# EAGLE design power supply board (EAGLE 9.6.2)
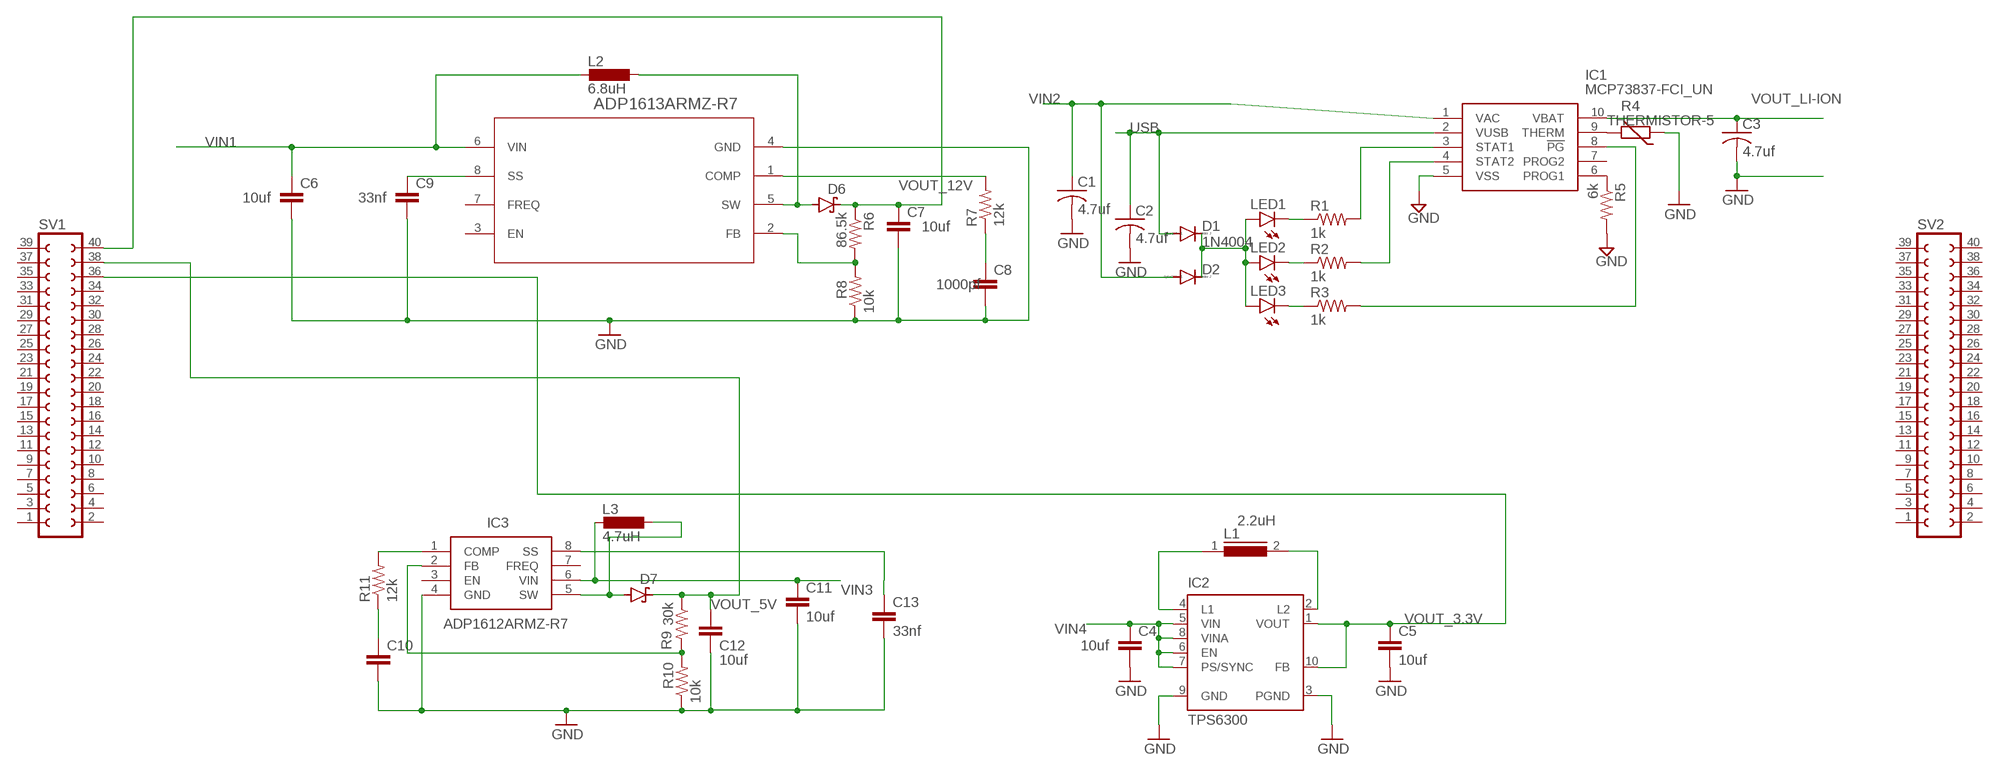
[diagram p0: schematic, sheet 1]

## Parts
C1  4.7uf  C-US025-024X044  [C025-024X044]
C2  4.7uf  C-US025-024X044  [C025-024X044]
C3  4.7uf  C-US025-024X044  [C025-024X044]
C4  10uf  C2,5-3  [C2.5-3]
C5  10uf  C2,5-3  [C2.5-3]
C6  10uf  C2,5-3  [C2.5-3]
C7  10uf  C2,5-3  [C2.5-3]
C8  1000pf  C2,5-3  [C2.5-3]
C9  33nf  C2,5-3  [C2.5-3]
C10  1200pf  C2,5-3  [C2.5-3]
C11  10uf  C2,5-3  [C2.5-3]
C12  10uf  C2,5-3  [C2.5-3]
C13  33nf  C2,5-3  [C2.5-3]
D1  1N4004  [DO41-10]
D2  1N4004  [DO41-10]
D6  3A,40V  MBRS320T3  [SMC]
D7  3A,40V  MBRS320T3  [SMC]
IC1  MCP73837-FCI_UN  [SOP50P490X110-10N]
IC2  TPS6300  [DRC-S-PVSON-N10]
IC3  ADP1612ARMZ-R7  [SOP65P490X110-8N]
L1  2.2uH  SLF7045  [SLF7045]
L2  6.8uH  DO3316P  [DO3316P]
L3  4.7uH  DO3316P  [DO3316P]
LED1  LAP4-BOTTOM  [P47F-BOTTOM]
LED2  LAP4-BOTTOM  [P47F-BOTTOM]
LED3  LAP4-BOTTOM  [P47F-BOTTOM]
R1  1k  R-US_0204/2V  [0204V]
R2  1k  R-US_0204/2V  [0204V]
R3  1k  R-US_0204/2V  [0204V]
R4  THERMISTOR-5  [R-5]
R5  6k  R-US_0204/2V  [0204V]
R6  86.5k  R-US_M0805  [M0805]
R7  12k  R-US_M0805  [M0805]
R8  10k  R-US_M0805  [M0805]
R9  30k  R-US_M0805  [M0805]
R10  10k  R-US_M0805  [M0805]
R11  12k  R-US_M0805  [M0805]
SV1  FE20-2  [FE20-2]
SV2  FE20-2  [FE20-2]
U1  ADP1613ARMZ-R7  [RM_8_ADI]

## Nets
GND: C1.2 C2.2 C3.2 C4.2 C5.2 C6.2 C7.2 C8.2 C9.2 C10.2 C11.2 C12.2 C13.2 IC1.5(VSS) IC2.3(PGND) IC2.9(GND) IC3.4(GND) R4.1 R5.2 R8.1 R10.1 U1.4(GND)
N$1: LED1.C R1.1
N$2: LED2.C R2.1
N$3: D1.C D2.C LED1.A LED2.A LED3.A
N$4: IC1.3(STAT1) R1.2
N$5: LED3.C R3.1
N$8: IC1.4(STAT2) R2.2
N$9: IC1.8(!PG) R3.2
N$10: IC1.6(PROG1) R5.1
N$11: IC1.9(THERM) R4.2
N$13: IC2.4(L1) L1.1
N$14: C13.1 IC3.8(SS)
N$15: IC2.2(L2) L1.2
N$16: D6.A L2.2 U1.5(SW)
N$18: C10.1 R11.1
N$19: C9.1 U1.8(SS)
N$20: R6.2 R8.2 U1.2(FB)
N$21: IC3.1(COMP) R11.2
N$22: R7.2 U1.1(COMP)
N$23: C8.1 R7.1
N$25: IC3.2(FB) R9.2 R10.2
USB: C2.1 D1.A IC1.2(VUSB)
VIN1: C6.1 L2.1 U1.6(VIN)
VIN2: C1.1 D2.A IC1.1(VAC)
VIN3: C11.1 IC3.6(VIN) L3.1
VIN4: C4.1 IC2.5(VIN) IC2.6(EN) IC2.7(PS/SYNC) IC2.8(VINA)
VOUT1: D7.A IC3.5(SW) L3.2
VOUT_3.3V: C5.1 IC2.1(VOUT) IC2.10(FB) SV1.36
VOUT_5V: C12.1 D7.C R9.1 SV1.38
VOUT_12V: C7.1 D6.C R6.1 SV1.40
VOUT_LI-ION: C3.1 IC1.10(VBAT)
Unconnected: IC1.7(PROG2) IC2.TH IC3.3(EN) IC3.7(FREQ) SV1.1 SV1.2 SV1.3 SV1.4 SV1.5 SV1.6 SV1.7 SV1.8 SV1.9 SV1.10 SV1.11 SV1.12 SV1.13 SV1.14 SV1.15 SV1.16 SV1.17 SV1.18 SV1.19 SV1.20 SV1.21 SV1.22 SV1.23 SV1.24 SV1.25 SV1.26 SV1.27 SV1.28 SV1.29 SV1.30 SV1.31 SV1.32 SV1.33 SV1.34 SV1.35 SV1.37 SV1.39 SV2.1 SV2.2 SV2.3 SV2.4 SV2.5 SV2.6 SV2.7 SV2.8 SV2.9 SV2.10 SV2.11 SV2.12 SV2.13 SV2.14 SV2.15 SV2.16 SV2.17 SV2.18 SV2.19 SV2.20 SV2.21 SV2.22 SV2.23 SV2.24 SV2.25 SV2.26 SV2.27 SV2.28 SV2.29 SV2.30 SV2.31 SV2.32 SV2.33 SV2.34 SV2.35 SV2.36 SV2.37 SV2.38 SV2.39 SV2.40 U1.3(EN) U1.7(FREQ)

## Library data of the parts
C1-C3 = rcl:C-US: CAPACITOR, American symbol; SPICEPREFIX: C
C4-C13 = capacitor-wima:C: CAPACITOR naming: grid - package width
D1 D2 = diode:1N4004: DIODE general purpose rectifier, 1 A
D6 D7 = diode:MBRS3*0T3: SCHOTTKY BARRIER RECTIFIER 3.0 AMPERES 20, 30, 40 VOLT Source: MBRS340T3-D.pdf
IC1 = MCP73837-FCI_UN:MCP73837-FCI_UN: Li-Ion Charger USB/DC 4.2V 1A PG MSOP10 Source: Datasheet <http://ww1.microchip.com/downloads/en/DeviceDoc/22071B.pdf>; ARROW_PART_NUMBER: MCP73837-FCI/UN; ARROW_PRICE-STOCK: https://www.arrow.com/en/products/mcp73837-fciun/microchip-technology; DESCRIPTION: Li-Ion Charger USB/DC 4.2V 1A PG MSOP10; HEIGHT: 1.1mm; MANUFACTURER_NAME: Microchip; MANUFACTURER_PART_NUMBER: MCP73837-FCI/UN; MOUSER_PART_NUMBER: 579-MCP73837-FCI/UN; MOUSER_PRICE-STOCK: https://www.mouser.co.uk/ProductDetail/Microchip-Technology/MCP73837-FCI-UN?qs=hH%252BOa0VZEiDKGj395FRsiw%3D%3D
IC2 = texas:TPS6300*: HIGH EFFICIENT SINGLE INDUCTOR BUCK-BOOST CONVERTER WITH 1.8-A SWITCHES Source: http://focus.ti.com/lit/ds/symlink/tps63001.pdf; MPN: TPS63000DRCTG4; OC_FARNELL: 1511852; OC_NEWARK: 59M7217
IC3 = ADP1612ARMZ-R7:ADP1612ARMZ-R7: Analog Devices ADP1612ARMZ-R7, Step Up DC-DC Converter, 1.9A, Adjustable, 5.5 20 V, 8-Pin MSOP Source: Datasheet <http://uk.rs-online.com/web/p/products/7427727P>; ARROW_PART_NUMBER: ADP1612ARMZ-R7; ARROW_PRICE-STOCK: https://www.arrow.com/en/products/adp1612armz-r7/analog-devices; DESCRIPTION: Analog Devices ADP1612ARMZ-R7, Step Up DC-DC Converter, 1.9A, Adjustable, 5.5 20 V, 8-Pin MSOP; HEIGHT: 1.1mm; MANUFACTURER_NAME: Analog Devices; MANUFACTURER_PART_NUMBER: ADP1612ARMZ-R7; MOUSER_PART_NUMBER: 584-ADP1612ARMZ-R7; MOUSER_PRICE-STOCK: https://www.mouser.com/Search/Refine.aspx?Keyword=584-ADP1612ARMZ-R7
L1 = inductors:SLF7045: SMD Inductors(Coils) For Power Line (Wound, Magnetic Shielded) Source: TDK, e531_slf7045.pdf; SPICEPREFIX: L
L2 L3 = inductor-coilcraft:DO3316P: COILCRAFT; OC_FARNELL: unknown; OC_NEWARK: unknown
LED1-LED3 = led:*P4: PointLED® Enhanced Thinfilm LED TOP & BOTTOM mount LS P47F, LR P47F, LA P47F, LY P47F, LT P4SG, LB P4SG, LW P4SG Source: http://catalog.osram-os.com .. LA_LR_LS_LY_P47F_Pb_free.pdf
R1-R3 R5-R11 = rcl:R-US_: RESISTOR, American symbol; SPICEPREFIX: R
R4 = varistor:THERMISTOR: THERMISTOR
SV1 SV2 = con-lsta:FE20-2: FEMALE HEADER; OC_FARNELL: unknown; OC_NEWARK: unknown
U1 = ADP:ADP1613ARMZ-R7: ADP1613ARMZ-R7 Li-Ion/Li-Polymer battery chargers; BUILT_BY: EMA_UL_Team; MANUFACTURER_PART_NUMBER: ADP1613ARMZ-R7; SOURCELIBRARY: Analog_2015-12-15; VENDOR: Analog Devices Inc

## Board
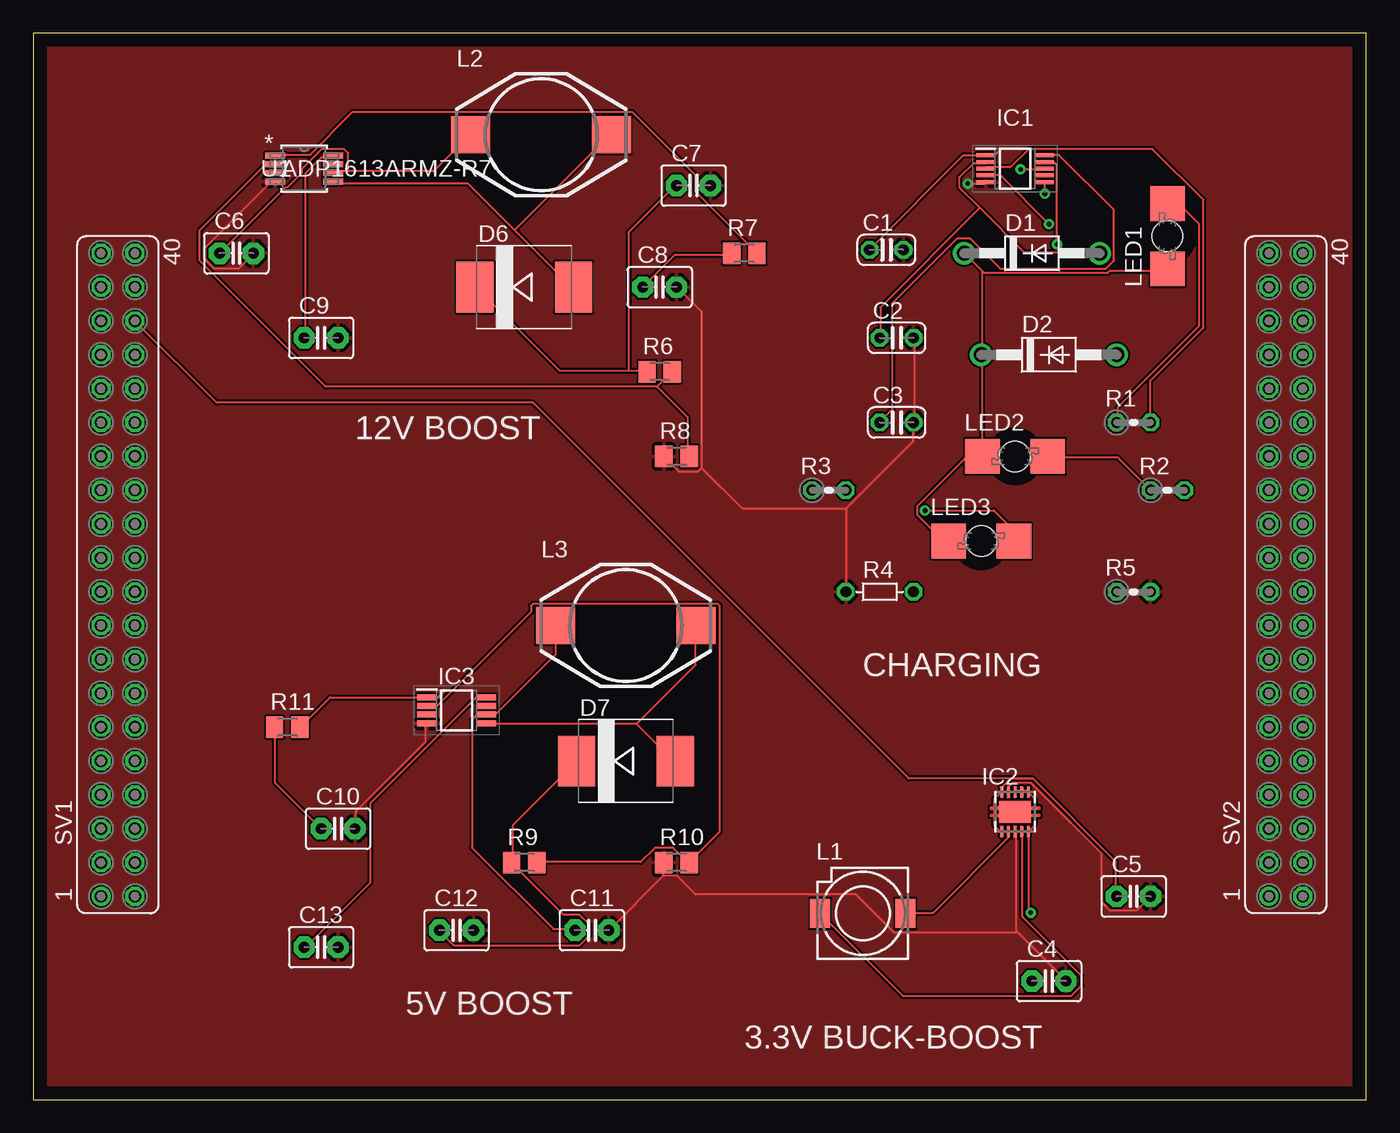
[diagram p1: board, top side]
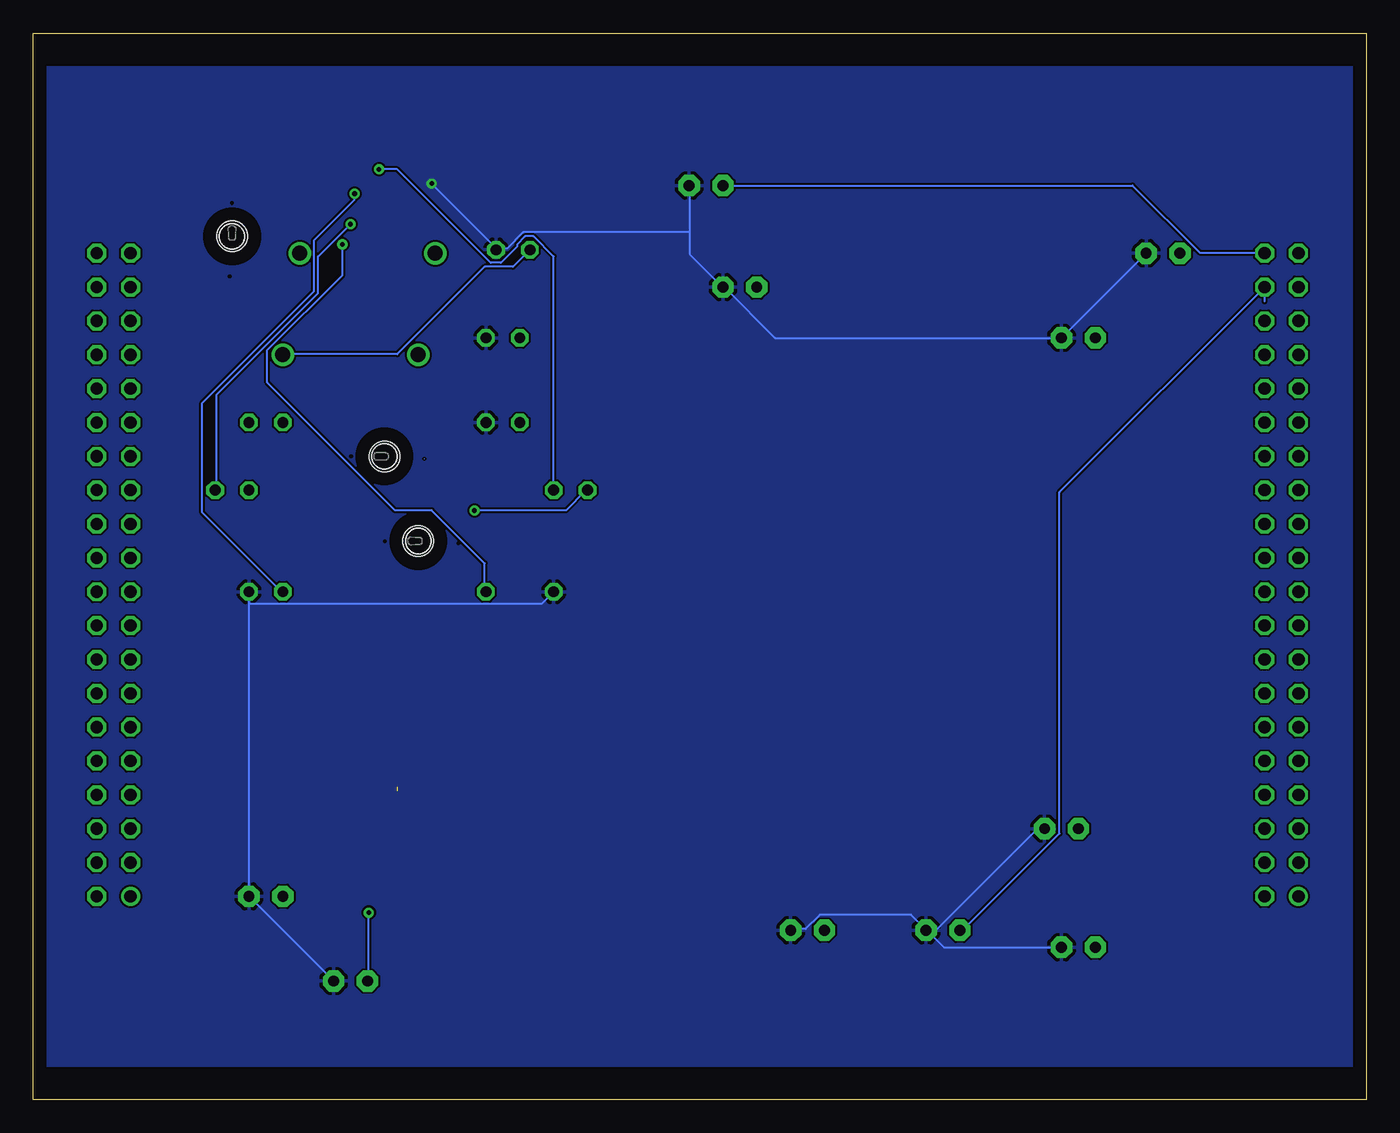
[diagram p2: board, bottom side, seen from below]

Size 100 x 80 mm. Coordinates in mm from the lower left corner, seen from the top.
Outline: 0,0 100,0 100,80 0,80 0,0
Copper layers (1*16): Top 0.035mm / dielectric 1.5mm / Bottom 0.035mm
Design rules "default": minimum track width 6mil, minimum drill 0.35mm, track to track 6mil, track to pad 6mil, pad to pad 6mil, via to via 6mil, smd to smd 6mil, copper to edge 40mil, drill to drill 6mil, minimum pad ring 10mil, minimum via ring 8mil, stop-mask expansion 4mil, vias tented up to drill 0mil, thermal gap 10mil

### Footprints (pad centres in the part's own frame; a part is rotated, then mirrored left to right if it is on the bottom)
C025-024X044 = drill 0.813 octagon: 1 -1.27,0; 2 1.27,0
C2.5-3 = drill 0.813 pad 1.6 octagon: 1 -1.27,0; 2 1.27,0
DO41-10 = drill 1.118: A 5.08,0; C -5.08,0
SMC = smd 2.8 x 3.8: A 3.7,0; C -3.7,0
SOP50P490X110-10N = smd 1.4 x 0.3: 1 -2.2,1; 2 -2.2,0.5; 3 -2.2,0; 4 -2.2,-0.5; 5 -2.2,-1; 6 2.2,-1; 7 2.2,-0.5; 8 2.2,0; 9 2.2,0.5; 10 2.2,1
DRC-S-PVSON-N10 = smd 0.28 x 0.85: 1 -1,-1.475; 2 -0.5,-1.475; 3 0,-1.475; 4 0.5,-1.475; 5 1,-1.475; 6 1,1.475; 7 0.5,1.475; 8 0,1.475; 9 -0.5,1.475; 10 -1,1.475 | smd 2.4 x 1.65: TH 0,0
SOP65P490X110-8N = smd 1.45 x 0.45: 1 -2.225,0.975; 2 -2.225,0.325; 3 -2.225,-0.325; 4 -2.225,-0.975; 5 2.225,-0.975; 6 2.225,-0.325; 7 2.225,0.325; 8 2.225,0.975
SLF7045 = smd 1.5 x 2.2: 1 -3.2,0; 2 3.2,0
DO3316P = smd 2.92 x 2.79: 1 -5.28,0; 2 5.28,0
P47F-BOTTOM = smd 2.6 x 2.6: A -2.45,0; C 2.45,0 | hole 2.3: 0,0
0204V = drill 0.813 octagon: 1 -1.27,0; 2 1.27,0
R-5 = drill 0.813 octagon: 1 -2.54,0; 2 2.54,0
M0805 = smd 1.3 x 1.6: 1 -0.95,0; 2 0.95,0
FE20-2 = drill 0.914: 1 -24.13,1.27 | drill 0.914 octagon: 2 -24.13,-1.27; 3 -21.59,1.27; 4 -21.59,-1.27; 5 -19.05,1.27; 6 -19.05,-1.27; 7 -16.51,1.27; 8 -16.51,-1.27; 9 -13.97,1.27; 10 -13.97,-1.27; 11 -11.43,1.27; 12 -11.43,-1.27; 13 -8.89,1.27; 14 -8.89,-1.27; 15 -6.35,1.27; 16 -6.35,-1.27; 17 -3.81,1.27; 18 -3.81,-1.27; 19 -1.27,1.27; 20 -1.27,-1.27; 21 1.27,1.27; 22 1.27,-1.27; 23 3.81,1.27; 24 3.81,-1.27; 25 6.35,1.27; 26 6.35,-1.27; 27 8.89,1.27; 28 8.89,-1.27; 29 11.43,1.27; 30 11.43,-1.27; 31 13.97,1.27; 32 13.97,-1.27; 33 16.51,1.27; 34 16.51,-1.27; 35 19.05,1.27; 36 19.05,-1.27; 37 21.59,1.27; 38 21.59,-1.27; 39 24.13,1.27; 40 24.13,-1.27
RM_8_ADI = smd 1.524 x 0.432: 1 -2.172,0.975; 2 -2.172,0.325; 3 -2.172,-0.325; 4 -2.172,-0.975; 5 2.172,-0.975; 6 2.172,-0.325; 7 2.172,0.325; 8 2.172,0.975

### Placement (x,y rotation side)
C1  64.01,63.75 0 top
C2  64.77,57.15 0 top
C3  64.77,50.8 0 top
C4  76.2,8.89 0 top
C5  82.55,15.24 0 top
C6  15.24,63.5 0 top
C7  49.53,68.58 0 top
C8  46.99,60.96 0 top
C9  21.59,57.15 0 top
C10  22.86,20.32 0 top
C11  41.91,12.7 0 top
C12  31.75,12.7 0 top
C13  21.59,11.43 0 top
D1  74.93,63.5 0 top
D2  76.2,55.88 0 top
D6  36.83,60.96 0 top
D7  44.45,25.4 0 top
IC1  73.66,69.85 0 top
IC2  73.66,21.59 0 top
IC3  31.75,29.21 0 top
L1  62.23,13.97 0 top
L2  38.1,72.39 0 top
L3  44.45,35.56 0 top
LED1  85.09,64.77 90 top
LED2  73.66,48.26 0 top
LED3  71.12,41.91 0 top
R1  82.55,50.8 0 top
R2  85.09,45.72 0 top
R3  59.69,45.72 0 top
R4  63.5,38.1 0 top
R5  82.55,38.1 0 top
R6  46.99,54.61 0 top
R7  53.34,63.5 0 top
R8  48.26,48.26 0 top
R9  36.83,17.78 0 top
R10  48.26,17.78 0 top
R11  19.05,27.94 0 top
SV1  6.35,39.37 90 top
SV2  93.98,39.37 90 top
U1  20.32,69.85 0 top

### Tracks (layer width: path | path; a pad name or v marks a point on that pad's centre or on a via)
GND  (via drill 0.35)
  Top 0.152: IC3.4 29.41,28.19 29.41,26.82 24.23,21.64 24.23,20.42 C10.2 | 47.24,16.76 47.24,17.68 R10.1 | C11.2 47.24,16.76 | 73.91,12.5 77.42,8.99 C4.2 | 73.91,12.5 73.76,12.65 73.76,19.96 IC2.3 | C5.2 82.75,14.17 80.77,14.17 80.16,14.78 80.16,18.44 74.83,23.77 73.46,23.77 73.15,23.47 73.15,23.16 IC2.9 | 60.96,44.35 R4.1 | 60.96,44.35 65.99,49.38 65.99,50.75 C3.2 66.14,50.9 66.14,57.15 C2.2 | U1.4 18.14,68.73 17.68,68.73 12.8,63.86 12.8,63.09 13.56,62.33 15.39,62.33 16.46,63.4 C6.2 | v70.1,68.73 71.32,68.73 IC1.5 | 50.14,47.4 49.84,47.09 48.46,47.09 47.4,48.16 R8.1 | 50.14,47.4 50.14,59.13 48.31,60.96 C8.2 | 60.96,44.35 53.19,44.35 50.14,47.4 | 47.24,16.76 48.31,16.76 49.68,15.39 61.72,15.39 64.62,12.5 73.91,12.5
  Bottom 0.152: C13.2 31.7,11.43 32.61,12.34 | 32.61,12.34 32.92,12.65 C12.2 | C11.2 43.13,12.8 42.06,12.8 41,13.87 34.14,13.87 33.07,12.8 C12.2 | 32.61,12.34 24.69,20.27 24.23,20.27 C10.2 | 32.61,12.34 C12.2 | 83.82,37.19 C5.2 C4.2 | 83.82,37.19 R5.2 | C6.2 C9.2 44.35,57.15 48.16,60.96 C8.2 48.31,60.96 50.75,63.4 50.75,65.08 | 65.23,63.86 v70.1,68.73 | 50.75,65.08 50.75,68.58 C7.2 | 65.23,63.86 64.47,63.86 63.25,65.08 50.75,65.08 | 65.23,63.86 C1.2 | 83.82,37.19 61.87,37.19 R4.1
  pour Top: -2.54,80.01 99.06,80.01 105.41,73.66 106.68,72.39 106.68,0 -6.35,0 -7.62,1.27 -7.62,74.93
  pour Bottom: -2.54,77.47 99.06,77.47 100.33,76.2 105.41,71.12 105.41,3.81 104.14,2.54 -12.7,2.54 -12.7,67.31
N$1
  Top 0.152: LED1.C 85.19,67.21 85.95,67.21 87.48,65.68 87.48,58.06 81.38,51.97 81.38,50.9 R1.1
N$2
  Top 0.152: R2.1 81.38,48.16 76.2,48.16 LED2.C
N$3
  Top 0.152: LED3.A 68.28,41.91 66.29,43.89 66.29,44.5 69.95,48.16 71.17,48.16 LED2.A 71.17,48.31 71.17,55.78 D2.C 71.17,55.93 71.17,62.18 | D1.C 71.17,62.18 | 71.17,62.18 71.32,62.03 80.62,62.03 80.77,62.18 85.04,62.18 LED1.A
N$4
  Top 0.152: R1.2 83.82,53.95 87.78,57.91 87.78,67.51 83.97,71.32 74.68,71.32 73.3,69.95 71.48,69.95 IC1.3
N$5  (via drill 0.35)
  Top 0.152: v66.9,44.2 72.08,44.2 73.46,42.82 73.46,41.91 LED3.C
  Bottom 0.152: v66.9,44.2 60.05,44.2 58.52,45.72 R3.1
N$8  (via drill 0.35)
  Top 0.152: v76.2,65.68 72.54,69.34 71.48,69.34 IC1.4
  Bottom 0.152: v76.2,65.68 78.64,63.25 78.64,60.5 86.26,52.88 86.26,45.72 R2.2
N$9  (via drill 0.35)
  Top 0.152: v74.07,69.8 75.74,69.8 IC1.8
  Bottom 0.152: v74.07,69.8 72.69,69.8 65.68,62.79 64.92,62.79 63.7,64.01 63.7,64.16 63.09,64.77 62.48,64.77 60.96,63.25 R3.2
N$10  (via drill 0.35)
  Top 0.152: v75.89,67.97 75.89,68.73 IC1.6
  Bottom 0.152: v75.89,67.97 75.89,67.51 78.94,64.47 78.94,60.66 87.33,52.27 87.33,44.04 81.38,38.1 R5.1
N$11  (via drill 0.35)
  Top 0.152: v76.81,64.16 76.81,70.1 76.66,70.26 75.89,70.26 IC1.9
  Bottom 0.152: v76.81,64.16 76.81,61.87 82.45,56.24 82.45,53.8 72.85,44.2 70.1,44.2 66.14,40.23 66.14,38.1 R4.2
N$13
  Top 0.152: IC2.4 74.22,19.96 74.22,13.72 78.64,9.3 78.64,8.53 77.88,7.77 65.23,7.77 59.13,13.87 L1.1
N$14
  Top 0.152: IC3.8 33.83,30.18 33.22,30.18 25.3,22.25 25.3,16.31 20.42,11.43 C13.1
N$15
  Top 0.152: IC2.2 73.15,19.96 73.15,19.66 67.51,14.02 65.53,14.02 L1.2
N$16
  Top 0.152: 36.12,65.23 40.39,60.96 D6.A | 36.12,65.23 32.61,68.73 22.55,68.73 U1.5 | 36.12,65.23 43.28,72.39 L2.2
N$18
  Top 0.152: C10.1 18.14,23.77 18.14,27.89 R11.1
N$19
  Top 0.152: U1.8 22.4,70.71 21.64,70.71 20.42,69.49 20.42,57.15 C9.1
N$20
  Top 0.152: 46.79,53.49 21.95,53.49 12.5,62.94 12.5,65.23 17.37,70.1 18.14,70.1 U1.2 | 46.79,53.49 47.85,54.56 R6.2 | 46.79,53.49 49.07,51.21 49.07,48.31 R8.2
N$21
  Top 0.152: IC3.1 29.41,30.18 22.25,30.18 20.12,28.04 R11.2
N$22
  Top 0.152: U1.1 18.29,70.87 20.73,70.87 23.93,74.07 44.96,74.07 49.68,69.34 49.68,68.12 54.25,63.55 R7.2
N$23
  Top 0.152: C8.1 48.16,63.4 52.27,63.4 R7.1
N$25
  Top 0.152: IC3.2 29.57,29.57 30.33,29.57 37.34,36.58 37.34,37.03 37.49,37.19 51.36,37.19 51.51,37.03 51.51,20.12 49.23,17.83 R10.2 49.07,17.83 48.01,18.9 46.63,18.9 45.57,17.83 37.8,17.83 R9.2
USB
  Top 0.152: 71.02,66.9 74.37,63.55 80.01,63.55 D1.A | 71.02,66.9 69.49,68.43 69.49,69.19 70.56,70.26 71.32,70.26 IC1.2 | 71.02,66.9 63.55,59.44 63.55,57.15 C2.1
VIN1
  Top 0.152: 23.62,69.65 30.02,69.65 32.77,72.39 L2.1 | 23.62,69.65 22.55,69.65 U1.6 | C6.1 18.9,68.43 19.05,68.43 20.12,69.49 20.12,69.8 21.64,71.32 23.32,71.32 23.62,71.02 23.62,69.65
VIN2
  Top 0.152: IC1.1 71.32,70.87 69.8,70.87 62.79,63.86 C1.1
  Bottom 0.152: C1.1 64.01,62.48 66.14,62.48 72.69,55.93 81.23,55.93 D2.A
VIN3
  Top 0.152: L3.1 39.17,35.51 39.17,33.38 34.75,28.96 33.98,28.96 IC3.6 33.83,28.8 33.22,28.8 32.92,28.5 32.92,18.9 39.01,12.8 40.54,12.8 C11.1
VIN4  (via drill 0.35)
  Top 0.152: IC2.8 73.76,23.16 74.07,23.16 IC2.7 74.22,23.16 74.52,23.16 IC2.6 74.68,23.01 75.13,22.55 75.13,20.57 74.68,20.12 IC2.5 74.68,19.96 74.68,14.17 v74.83,14.02
  Bottom 0.152: v74.83,14.02 74.83,8.99 C4.1
VOUT1
  Top 0.152: 45.26,28.19 33.98,28.19 IC3.5 | 45.26,28.19 48.01,25.45 D7.A | 45.26,28.19 49.68,32.61 49.68,35.51 L3.2
VOUT_3.3V  (1 unrouted)
  Top 0.152: IC2.1 72.54,20.12 72.08,20.57 72.08,22.55 72.54,23.01 IC2.10 72.69,23.16 | 72.69,23.47 73.3,24.08 74.98,24.08 | 74.98,24.08 81.23,17.83 81.23,15.24 C5.1 | 74.98,24.08 65.69,24.08 37.48,52.29 13.75,52.29 SV1.36
VOUT_5V
  Top 0.152: D7.C 40.69,25.3 35.97,20.57 35.97,17.83 R9.1 35.97,17.68 39.78,13.87 41,13.87 41.76,13.11 41.76,12.34 41,11.58 31.55,11.58 30.48,12.65 C12.1
  Bottom 0.152: 7.62,59.89 SV1.38 23.01,45.57 23.01,19.96 30.18,12.8 30.48,12.8 C12.1
VOUT_12V
  Top 0.152: 44.65,54.71 39.47,54.71 33.22,60.96 D6.C | 44.65,54.71 46.02,54.71 R6.1 | 44.65,54.71 44.65,65.08 48.16,68.58 C7.1
  Bottom 0.152: C7.1 17.53,68.58 12.5,63.55 7.62,63.55 SV1.40
VOUT_LI-ION
  Top 0.152: IC1.10 75.89,70.87 76.96,70.87 81.08,66.75 81.08,62.94 80.47,62.33 72.54,62.33 70.26,64.62 69.34,64.62 64.47,59.74 64.47,51.82 63.55,50.9 C3.1

### Text on the board
tPlace: 12V BOOST | CHARGING | 5V BOOST | 3.3V BUCK-BOOST